# Altium schematic sheet Sheet3.SCHDOC
size 593 x 439 mm; DocumentNumber: ЕМС.02.00.200 Э3; SheetNumber: 3; SheetTotal: 4; DocumentName: Sheet3.SCHDOC
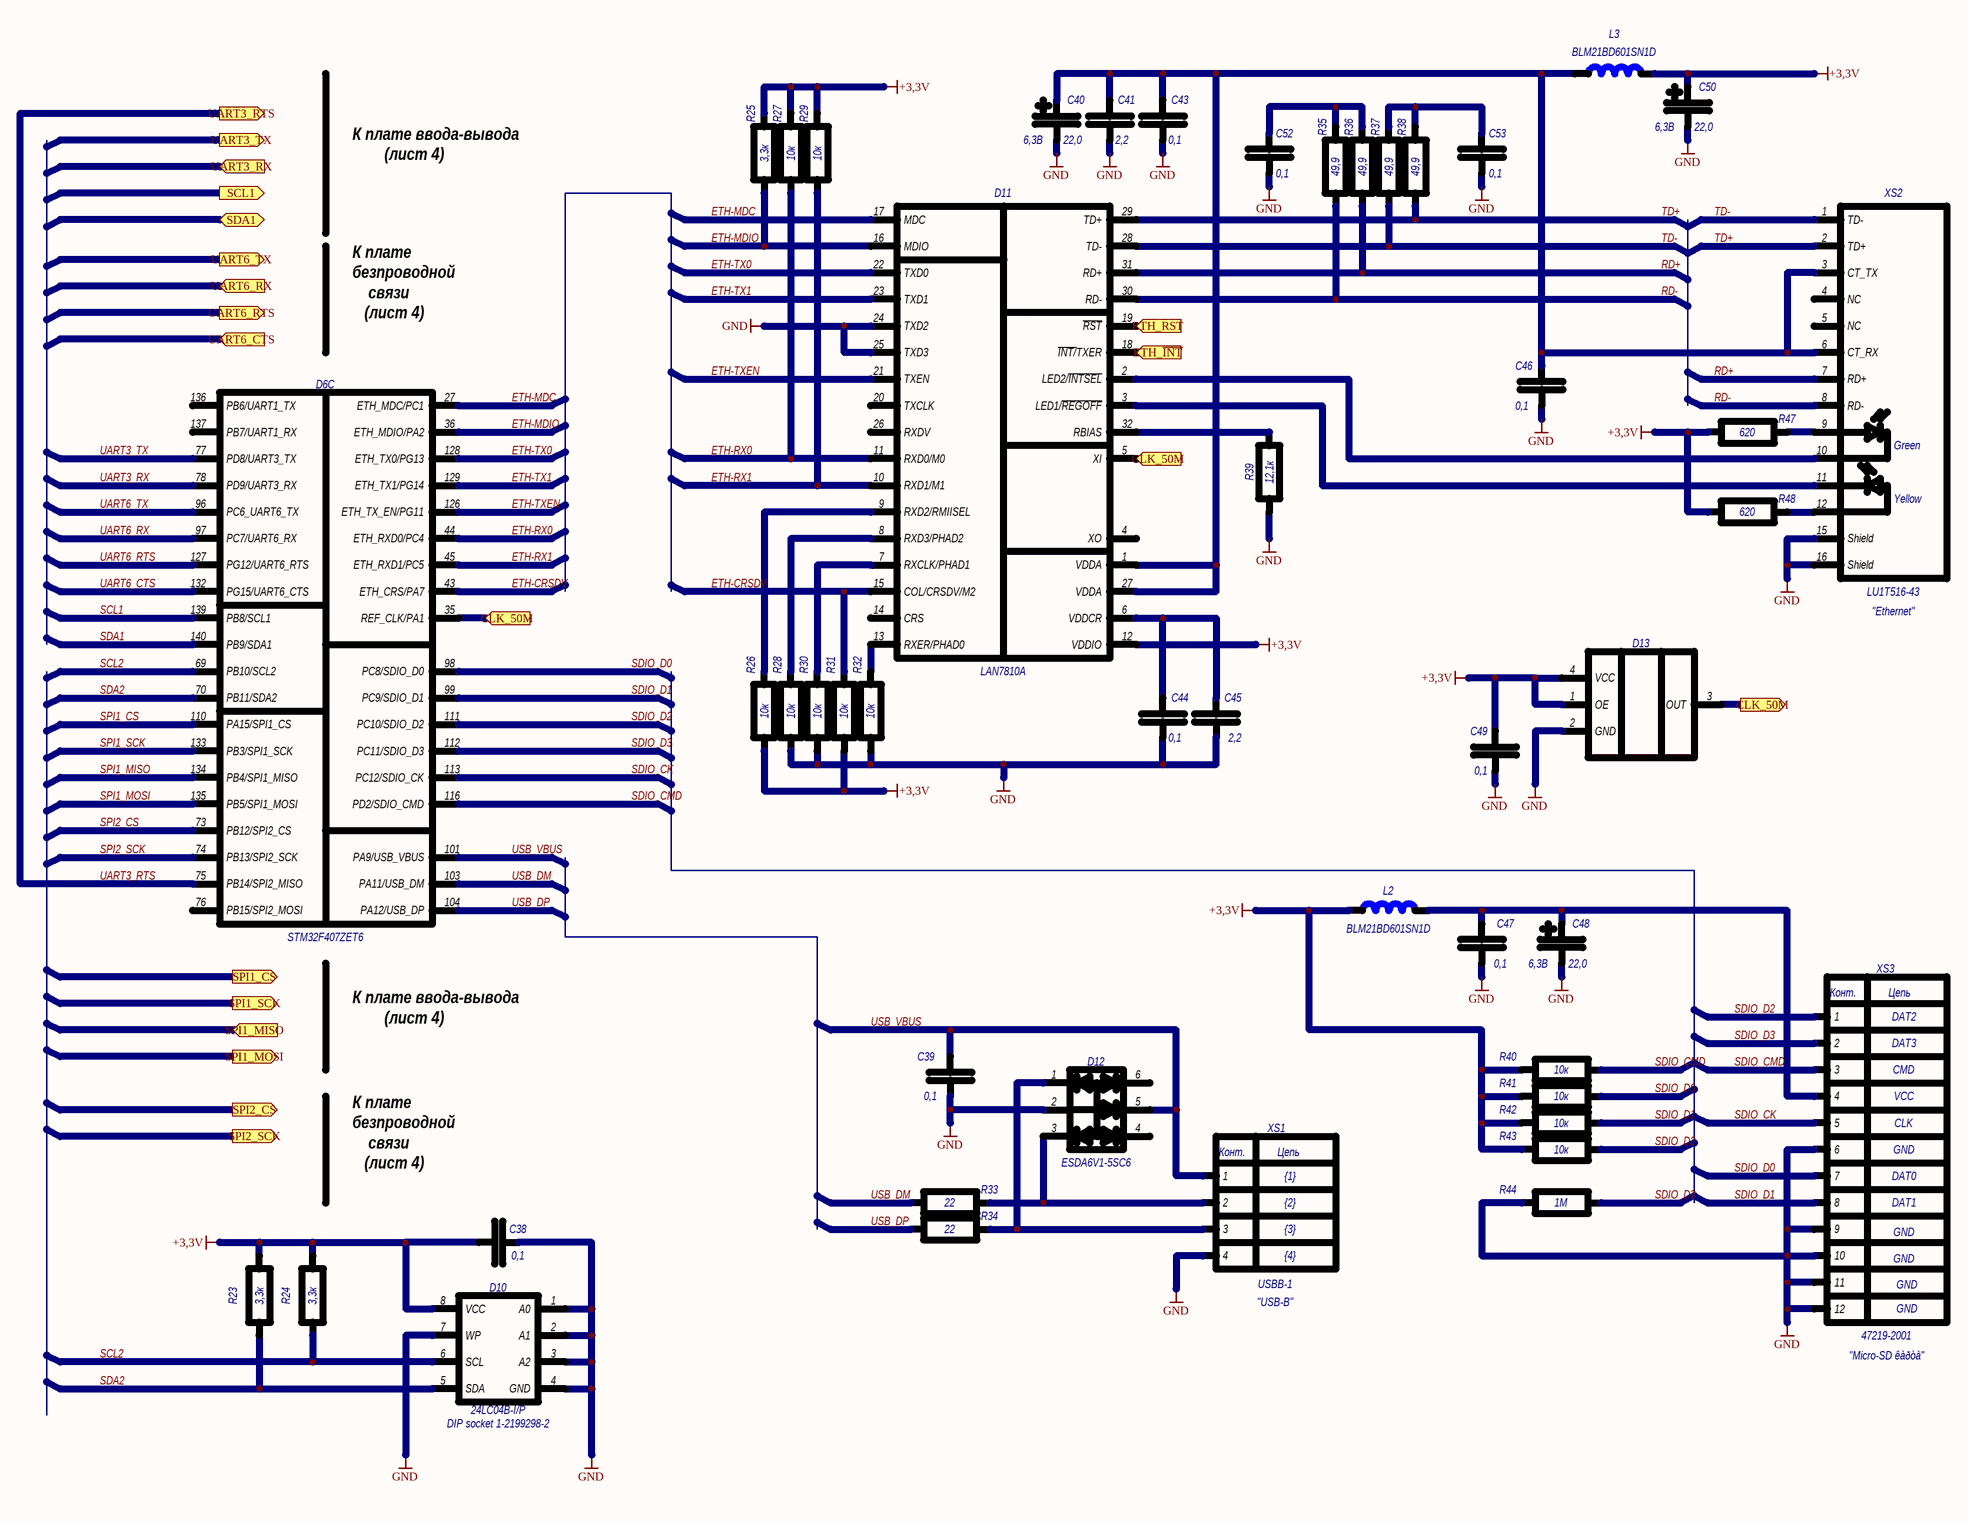
[diagram p0: Sheet3.SCHDOC]

## Parts
C38  value 0,1  [0805]  (hidden comment: К0805)
C39  value 0,1  [0805]  (hidden comment: К0805)
C40  value 22,0  TG: 6,3В  [TANTAL]  (hidden comment: КТ)
C41  value 2,2  [0805]  (hidden comment: К0805)
C43  value 0,1  [0805]  (hidden comment: К0805)
C44  value 0,1  [0805]  (hidden comment: К0805)
C45  value 2,2  [0805]  (hidden comment: К0805)
C46  value 0,1  [0805]  (hidden comment: К0805)
C47  value 0,1  [0805]  (hidden comment: К0805)
C48  value 22,0  TG: 6,3В  [TANTAL]  (hidden comment: КТ)
C49  value 0,1  [0805]  (hidden comment: К0805)
C50  value 22,0  TG: 6,3В  [TANTAL]  (hidden comment: КТ)
C52  value 0,1  [0805]  (hidden comment: К0805)
C53  value 0,1  [0805]  (hidden comment: К0805)
D6  STM32F407ZET6  [LQFP-144]  (part C of 4)
D10  24LC04B-I/P  value DIP socket 1-2199298-2  [DIP-08]
D11  LAN7810A  [QFN-32-5X5]
D12  ESDA6V1-5SC6  [SOT-23-6]
D13  KXO-V97  [SG0705]  (value not drawn)
L2  value BLM21BD601SN1D  [0805]  (hidden comment: BLM21BD222)
L3  value BLM21BD601SN1D  [0805]  (hidden comment: BLM21BD222)
R23  Р0805  [0805]  (value not drawn)
R24  Р0805  [0805]  (value not drawn)
R25  Р0805  [0805]  (value not drawn)
R26  Р0805  [0805]  (value not drawn)
R27  Р0805  [0805]  (value not drawn)
R28  Р0805  [0805]  (value not drawn)
R29  Р0805  [0805]  (value not drawn)
R30  Р0805  [0805]  (value not drawn)
R31  Р0805  [0805]  (value not drawn)
R32  Р0805  [0805]  (value not drawn)
R33  value 22  [0805]  (hidden comment: Р0805)
R34  value 22  [0805]  (hidden comment: Р0805)
R35  value 49,9  [0805]  (hidden comment: Р0805)
R36  value 49,9  [0805]  (hidden comment: Р0805)
R37  value 49,9  [0805]  (hidden comment: Р0805)
R38  value 49,9  [0805]  (hidden comment: Р0805)
R39  Р0805  [0805]  (value not drawn)
R40  Р0805  [0805]  (value not drawn)
R41  Р0805  [0805]  (value not drawn)
R42  Р0805  [0805]  (value not drawn)
R43  Р0805  [0805]  (value not drawn)
R44  value 1M  [0805]  (hidden comment: Р0805)
R47  value 620  [0805]  (hidden comment: Р0805)
R48  value 620  [0805]  (hidden comment: Р0805)
XS1  USBB-1  4: {4}  1: {1}  2: {2}  3: {3}  [USB-B]
XS2  LU1T516-43  [LU1T516-43]
XS3  47219-2001  10: GND  7: DAT0  5: CLK  4: VCC  2: DAT3  1: DAT2  8: DAT1  3: CMD  [47219-2001]

## Ports
CLK_50M (in), CLK_50M (out), ETH_RST (in), ETH_~{INT} (in), SCL1 (out), SDA1 (bidir), SPI1_CS (out), SPI1_MISO (in), SPI1_MOSI (out), SPI1_SCK (out), SPI2_CS (out), SPI2_SCK (out), UART3_RTS (out), UART3_RX (in), UART3_TX (out), UART6_CTS (in), UART6_RTS (out), UART6_RX (in), UART6_TX (out)

## Nets
+3,3V: C38.1 C49.2 C50.1(Plus) D10.8(VCC) D11.12(VDDIO) D13.1(OE) D13.4(VCC) L2.2 L3.2 R23.2 R24.2 R25.2 R26.2 R27.2 R29.2 R31.2 R40.2 R41.2 R42.2 R43.2 R47.1 R48.1
GND: C38.2 C39.1 C40.2(Minus) C41.2 C43.2 C44.2 C45.2 C46.1 C47.2 C48.2(Minus) C49.1 C50.2(Minus) C52.1 C53.1 D10.1(A0) D10.2(A1) D10.3(A2) D10.4(GND) D10.7(WP) D11.24(TXD2) D11.25(TXD3) D11.33(GND) D11.34(GND) D11.35(GND) D11.36(GND) D12.2 D13.2(GND) R28.2 R30.2 R32.2 R39.2 R44.2 XS1.4 XS2.15(Shield) XS2.16(Shield) XS3.6 XS3.9 XS3.10 XS3.11 XS3.12
CLK_50M: D6.35(REF_CLK/PA1) D11.5(XI) D13.3(OUT) ; port CLK_50M
ETH-CRSDV: D6.43(ETH_CRS/PA7) D11.15(COL/CRSDV/M2) R31.1
ETH-MDC: D6.27(ETH_MDC/PC1) D11.17(MDC)
ETH-MDIO: D6.36(ETH_MDIO/PA2) D11.16(MDIO) R25.1
ETH-RX0: D6.44(ETH_RXD0/PC4) D11.11(RXD0/M0) R27.1
ETH-RX1: D6.45(ETH_RXD1/PC5) D11.10(RXD1/M1) R29.1
ETH-TX0: D6.128(ETH_TX0/PG13) D11.22(TXD0)
ETH-TX1: D6.129(ETH_TX1/PG14) D11.23(TXD1)
ETH-TXEN: D6.126(ETH_TX_EN/PG11) D11.21(TXEN)
ETH_~{INT}: D11.18(~{INT/}TXER) ; port ETH_~{INT}
ETH_RST: D11.19(~{RST}) ; port ETH_RST
RD+: D11.31(RD+) R36.1 XS2.7(RD+)
RD-: D11.30(RD-) R35.1 XS2.8(RD-)
SCL1: D6.139(PB8/SCL1)
SCL2: D6.69(PB10/SCL2) D10.6(SCL) R24.1
SDA1: D6.140(PB9/SDA1)
SDA2: D6.70(PB11/SDA2) D10.5(SDA) R23.1
SDIO_CK: D6.113(PC12/SDIO_CK) XS3.5
SDIO_CMD: D6.116(PD2/SDIO_CMD) R40.1 XS3.3
SDIO_D0: D6.98(PC8/SDIO_D0) R41.1 XS3.7
SDIO_D1: D6.99(PC9/SDIO_D1) R42.1 XS3.8
SDIO_D2: D6.111(PC10/SDIO_D2) R43.1 XS3.1
SDIO_D3: D6.112(PC11/SDIO_D3) R44.1 XS3.2
SPI1_CS: D6.110(PA15/SPI1_CS)
SPI1_MISO: D6.134(PB4/SPI1_MISO)
SPI1_MOSI: D6.135(PB5/SPI1_MOSI)
SPI1_SCK: D6.133(PB3/SPI1_SCK)
SPI2_CS: D6.73(PB12/SPI2_CS)
SPI2_SCK: D6.74(PB13/SPI2_SCK)
TD+: D11.29(TD+) R38.1 XS2.2(TD+)
TD-: D11.28(TD-) R37.1 XS2.1(TD-)
UART3_RTS: D6.75(PB14/SPI2_MISO) ; port UART3_RTS
UART3_RX: D6.78(PD9/UART3_RX)
UART3_TX: D6.77(PD8/UART3_TX)
UART6_CTS: D6.132(PG15/UART6_CTS)
UART6_RTS: D6.127(PG12/UART6_RTS)
UART6_RX: D6.97(PC7/UART6_RX)
UART6_TX: D6.96(PC6_UART6_TX)
USB_DM: D6.103(PA11/USB_DM) R33.2
USB_DP: D6.104(PA12/USB_DP) R34.2
USB_VBUS: C39.2 D6.101(PA9/USB_VBUS) D12.5(C) XS1.1
NetC40_1: C40.1(Plus) C41.1 C43.1 C46.2 D11.1(VDDA) D11.27(VDDA) L3.1 XS2.3(CT_TX) XS2.6(CT_RX)
NetC44_1: C44.1 C45.1 D11.6(VDDCR)
NetC47_1: C47.1 C48.1(Plus) L2.1 XS3.4
NetC52_2: C52.2 R35.2 R36.2
NetC53_2: C53.2 R37.2 R38.2
NetD11_2: D11.2(LED2/~{INTSEL}) XS2.10
NetD11_3: D11.3(LED1/~{REGOFF}) XS2.11
NetD11_7: D11.7(RXCLK/PHAD1) R30.1
NetD11_8: D11.8(RXD3/PHAD2) R28.1
NetD11_9: D11.9(RXD2/RMIISEL) R26.1
NetD11_13: D11.13(RXER/PHAD0) R32.1
NetD11_32: D11.32(RBIAS) R39.1
NetD12_1: D12.1 R34.1 XS1.3
NetD12_3: D12.3 R33.1 XS1.2
NetR47_2: R47.2 XS2.9
NetR48_2: R48.2 XS2.12

Not connected (* = marked no-connect by the designer): D6 49 76(PB15/SPI2_MOSI) 136(PB6/UART1_TX) 137(PB7/UART1_RX); D11 4(XO) 14(CRS) 20(TXCLK) 26(RXDV); D12 4 6(C); XS2 4(NC) 5(NC) 13 14

## Notes on the sheet
- К плате ввода-вывода
  (лист 4)
- (near D6) К плате
  безпроводной
  связи
  (лист 4)
- (near XS2) "Ethernet"
- (near C38) К плате
  безпроводной
  связи
  (лист 4)
- "USB-B"
- (near XS3) "Micro-SD êàðòà"
- Подп. и дата
- Инв. № дубл.
- Взам. инв. №
- Инв. № подл.
- Лист
- Изм.
- № докум.
- Подп.
- Дата
- (in symbol 47219-2001) Конт.; Цепь
- (in symbol LU1T516-43) Green; Yellow
- (in symbol USBB-1) Конт.; Цепь
- (in symbol Р0805) 10к; 3,3к; 12,1к

## Library data of the parts
C38 C39 C41 C43-C47 C52 C53 = К0805: КОНДЕНСАТОР; TG: NP0; TO: 5%; TU: {TU}; NO: {NO}; RefDes2: {RefDes2}; ComponentHeight: 1
C40 C48 C50 = КТ: КОНДЕНСАТОР; TU: {TU}; TO: {TO}; NO: {NO}; RefDes2: {RefDes2}; ComponentHeight: {ComponentHeight}
C49 = К0805_VARIANT_1: КОНДЕНСАТОР; TG: NP0; TO: 5%; TU: {TU}; NO: {NO}; RefDes2: {RefDes2}; ComponentHeight: 1
D12 = ESDA6V1-5SC6: {Description}; NO: {NO}; TG: {TG}; TO: {TO}; TU: {TU}; RefDes2: {RefDes2}; ComponentHeight: {ComponentHeight}
L2 L3 = BLM21BD222: {Description}; TU: {TU}; TO: {TO}; TG: {TG}; NO: {NO}; RefDes2: {RefDes2}; ComponentHeight: {ComponentHeight}
R23-R44 R47 R48 = Р0805: РЕЗИСТОР; TG: 0,125; TO: 1%; TU: {TU}; NO: {NO}; RefDes2: {RefDes2}; ComponentHeight: 1
XS1 = USBB-1: РОЗЕТКА; TU: {TU}; TG: {TG}; TO: {TO}; NO: 2436; RefDes2: {RefDes2}; N1: 1; ComponentHeight: 11.2
XS2 = LU1T516-43: РОЗЕТКА; TU: {TU}; TO: {TO}; NO: 2037; TG: {TG}; RefDes2: {RefDes2}; ComponentHeight: {ComponentHeight}
XS3 = 47219-2001: {Description}; TG: {TG}; TO: {TO}; RefDes2: {RefDes2}; TU: {TU}; NO: {NO}; 9: GND; 11: GND; 12: GND; 6: GND; ComponentHeight: {ComponentHeight}
D13 = KXO-V97: Value: *